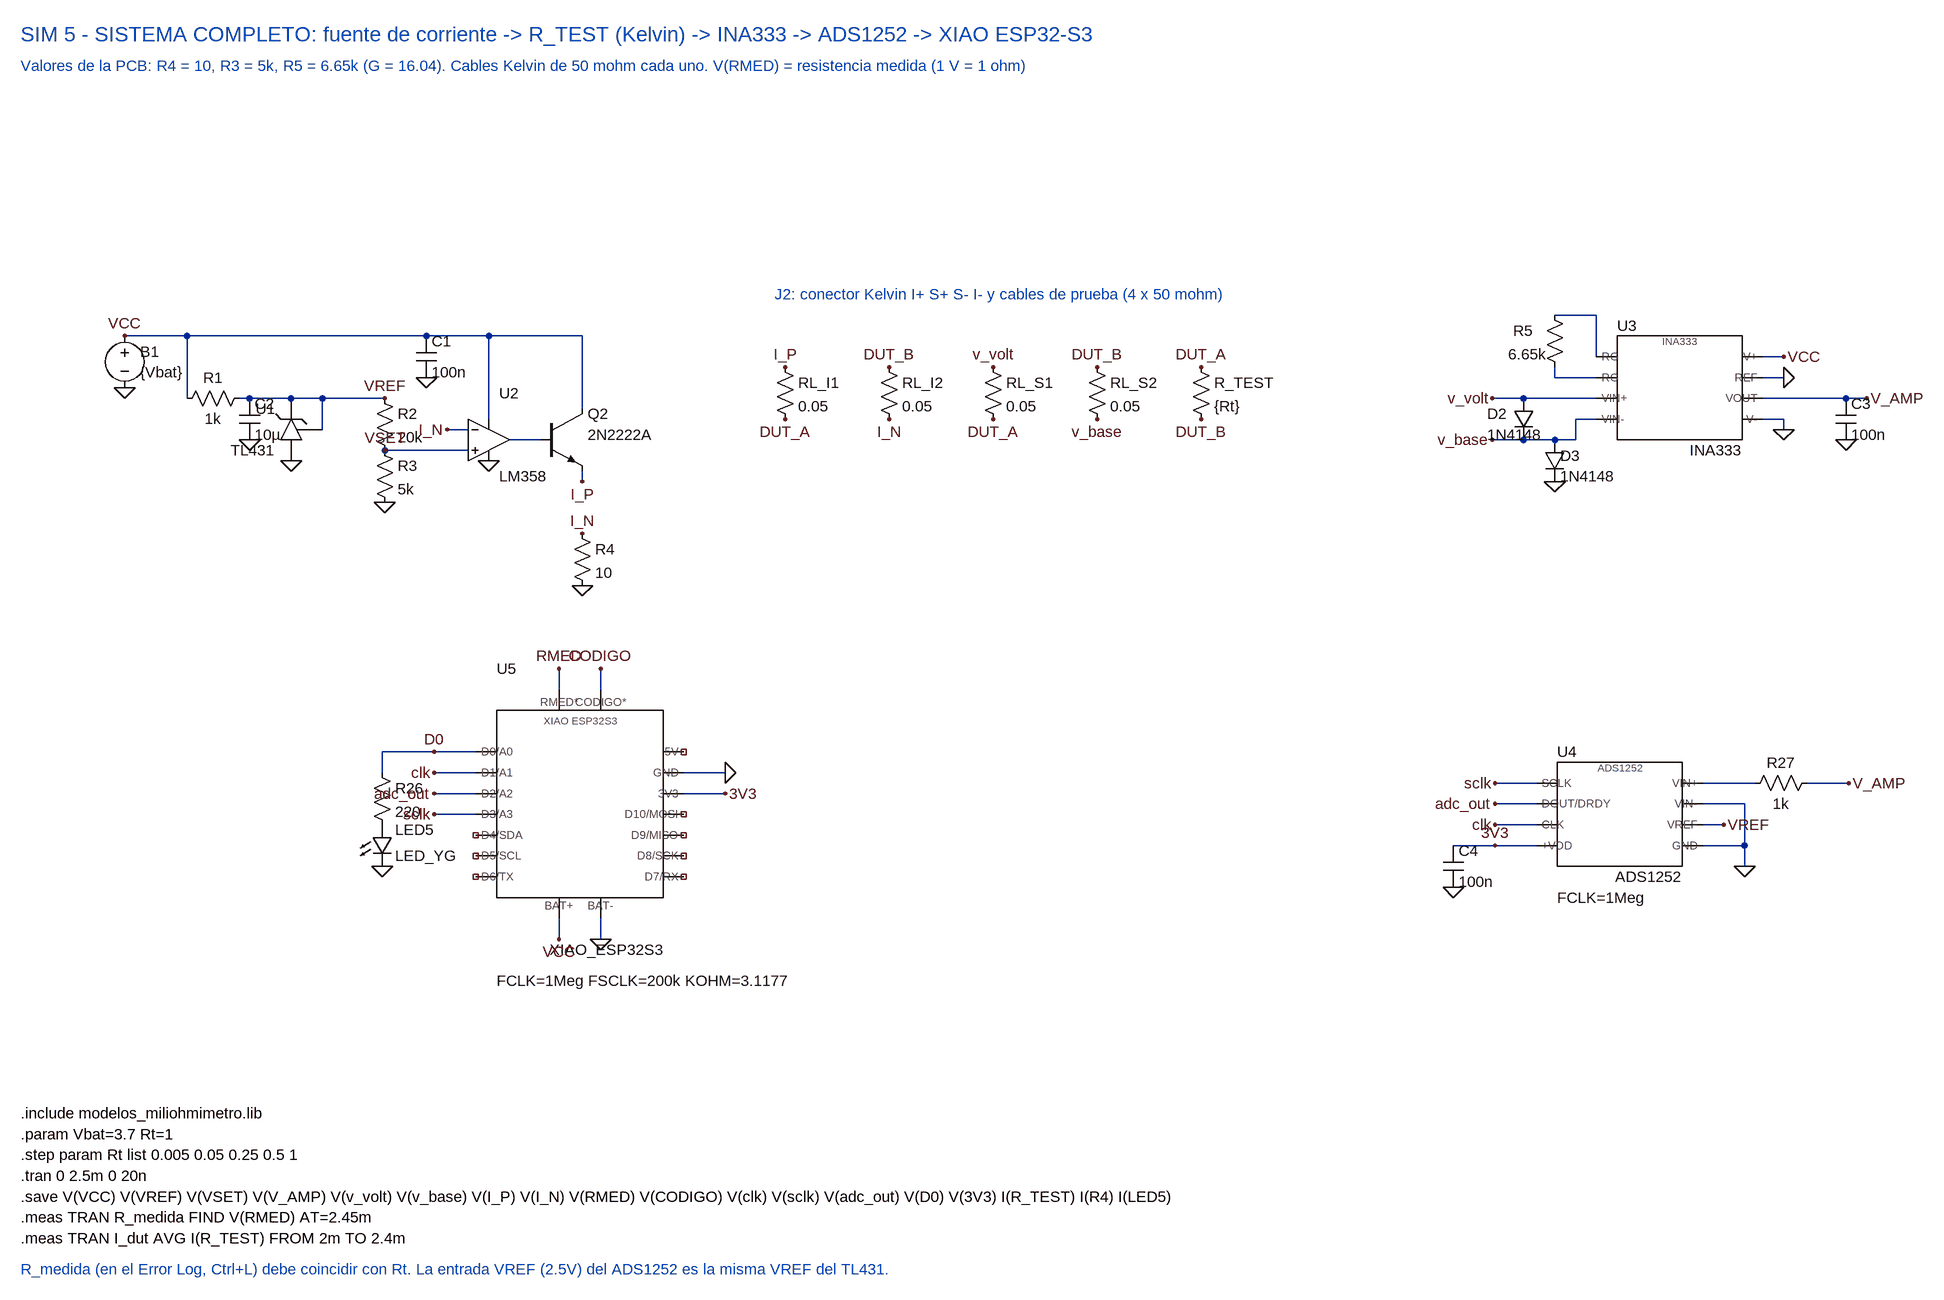
[diagram p0: schematic Sim5_Sistema_Completo.asc]
Sim5_Sistema_Completo.asc, the LTspice schematic file:
Version 4
SHEET 1 3600 2400
WIRE 0 -96 96 -96
WIRE 96 -96 560 -96
WIRE 560 -96 704 -96
WIRE 96 -96 96 0
WIRE 176 0 304 0
WIRE 304 0 400 0
WIRE 304 48 304 0
WIRE 400 80 528 80
WIRE 560 32 560 -96
WIRE 528 48 496 48
WIRE 592 64 640 64
WIRE 704 16 704 -96
WIRE 704 112 704 128
WIRE 2104 0 2264 0
WIRE 2104 64 2232 64
WIRE 2232 64 2232 32
WIRE 2232 32 2264 32
WIRE 2200 -128 2264 -128
WIRE 2264 -128 2264 -64
WIRE 2200 -48 2200 -32
WIRE 2200 -32 2264 -32
WIRE 2520 -64 2552 -64
WIRE 2520 -32 2552 -32
WIRE 2520 32 2552 32
WIRE 2552 32 2552 48
WIRE 2520 0 2680 0
WIRE 2428 592 2508 592
WIRE 2588 592 2652 592
WIRE 2428 624 2492 624
WIRE 2492 624 2492 688
WIRE 2428 688 2492 688
WIRE 2492 688 2492 720
WIRE 2428 656 2460 656
WIRE 2172 592 2108 592
WIRE 2172 624 2108 624
WIRE 2172 656 2108 656
WIRE 2172 688 2108 688
WIRE 2044 688 2108 688
WIRE 540 544 476 544
WIRE 540 576 476 576
WIRE 540 608 476 608
WIRE 540 640 476 640
WIRE 860 576 924 576
WIRE 860 608 924 608
WIRE 668 800 668 832
WIRE 732 800 732 832
WIRE 668 448 668 416
WIRE 732 448 732 416
WIRE 476 544 396 544
WIRE 396 544 396 576
FLAG 0 -16 0
FLAG 0 -96 VCC
FLAG 192 64 0
FLAG 256 96 0
FLAG 400 0 VREF
FLAG 400 160 0
FLAG 400 80 VSET
FLAG 464 -32 0
FLAG 560 96 0
FLAG 496 48 I_N
FLAG 704 128 I_P
FLAG 704 288 0
FLAG 704 208 I_N
FLAG 1016 -48 I_P
FLAG 1016 32 DUT_A
FLAG 1176 -48 DUT_B
FLAG 1176 32 I_N
FLAG 1336 -48 v_volt
FLAG 1336 32 DUT_A
FLAG 1496 -48 DUT_B
FLAG 1496 32 v_base
FLAG 1656 -48 DUT_A
FLAG 1656 32 DUT_B
FLAG 2104 0 v_volt
FLAG 2104 64 v_base
FLAG 2200 128 0
FLAG 2552 -64 VCC
FLAG 2552 -32 0
FLAG 2552 48 0
FLAG 2680 0 V_AMP
FLAG 2648 64 0
FLAG 2652 592 V_AMP
FLAG 2492 720 0
FLAG 2460 656 VREF
FLAG 2108 592 sclk
FLAG 2108 624 adc_out
FLAG 2108 656 clk
FLAG 2108 688 3V3
FLAG 2044 752 0
FLAG 476 544 D0
FLAG 476 576 clk
FLAG 476 608 adc_out
FLAG 476 640 sclk
FLAG 924 576 0
FLAG 924 608 3V3
FLAG 668 832 VCC
FLAG 732 832 0
FLAG 668 416 RMED
FLAG 732 416 CODIGO
FLAG 396 720 0
SYMBOL voltage 0 -112 R0
WINDOW 0 24 40 Left 2
WINDOW 3 24 72 Left 2
SYMATTR InstName B1
SYMATTR Value {Vbat}
SYMBOL res 192 -16 R90
WINDOW 0 0 56 VBottom 2
WINDOW 3 32 56 VTop 2
SYMATTR InstName R1
SYMATTR Value 1k
SYMBOL cap 176 0 R0
WINDOW 0 24 8 Left 2
WINDOW 3 24 56 Left 2
SYMATTR InstName C2
SYMATTR Value 10µ
SYMBOL TL431 256 0 R0
SYMATTR InstName U1
SYMATTR Value TL431
SYMBOL res 384 -16 R0
WINDOW 0 36 40 Left 2
WINDOW 3 36 76 Left 2
SYMATTR InstName R2
SYMATTR Value 20k
SYMBOL res 384 64 R0
WINDOW 0 36 40 Left 2
WINDOW 3 36 76 Left 2
SYMATTR InstName R3
SYMATTR Value 5k
SYMBOL cap 448 -96 R0
WINDOW 0 24 8 Left 2
WINDOW 3 24 56 Left 2
SYMATTR InstName C1
SYMATTR Value 100n
SYMBOL OpAmps\\opamp2 560 0 R0
WINDOW 0 16 -8 Left 2
WINDOW 3 16 120 Left 2
SYMATTR InstName U2
SYMATTR Value LM358
SYMBOL npn 640 16 R0
WINDOW 0 72 8 Left 2
WINDOW 3 72 40 Left 2
SYMATTR InstName Q2
SYMATTR Value 2N2222A
SYMBOL res 688 192 R0
WINDOW 0 36 40 Left 2
WINDOW 3 36 76 Left 2
SYMATTR InstName R4
SYMATTR Value 10
SYMBOL res 1000 -64 R0
WINDOW 0 36 40 Left 2
WINDOW 3 36 76 Left 2
SYMATTR InstName RL_I1
SYMATTR Value 0.05
SYMBOL res 1160 -64 R0
WINDOW 0 36 40 Left 2
WINDOW 3 36 76 Left 2
SYMATTR InstName RL_I2
SYMATTR Value 0.05
SYMBOL res 1320 -64 R0
WINDOW 0 36 40 Left 2
WINDOW 3 36 76 Left 2
SYMATTR InstName RL_S1
SYMATTR Value 0.05
SYMBOL res 1480 -64 R0
WINDOW 0 36 40 Left 2
WINDOW 3 36 76 Left 2
SYMATTR InstName RL_S2
SYMATTR Value 0.05
SYMBOL res 1640 -64 R0
WINDOW 0 36 40 Left 2
WINDOW 3 36 76 Left 2
SYMATTR InstName R_TEST
SYMATTR Value {Rt}
SYMBOL INA333 2392 0 R0
WINDOW 0 -96 -112 Left 2
WINDOW 3 96 80 Right 2
SYMATTR InstName U3
SYMATTR Value INA333
SYMBOL diode 2136 0 R0
WINDOW 0 -40 24 Left 2
WINDOW 3 -40 56 Left 2
SYMATTR InstName D2
SYMATTR Value 1N4148
SYMBOL diode 2184 64 R0
WINDOW 0 24 24 Left 2
WINDOW 3 24 56 Left 2
SYMATTR InstName D3
SYMATTR Value 1N4148
SYMBOL res 2184 -144 R0
WINDOW 0 -48 40 Left 2
WINDOW 3 -56 76 Left 2
SYMATTR InstName R5
SYMATTR Value 6.65k
SYMBOL cap 2632 0 R0
WINDOW 0 24 8 Left 2
WINDOW 3 24 56 Left 2
SYMATTR InstName C3
SYMATTR Value 100n
SYMBOL ADS1252 2300 640 R0
WINDOW 0 -96 -96 Left 2
WINDOW 3 96 96 Right 2
WINDOW 39 -96 128 Left 2
SYMATTR InstName U4
SYMATTR Value ADS1252
SYMATTR SpiceLine FCLK=1Meg
SYMBOL res 2604 576 R90
WINDOW 0 0 56 VBottom 2
WINDOW 3 32 56 VTop 2
SYMATTR InstName R27
SYMATTR Value 1k
SYMBOL cap 2028 688 R0
WINDOW 0 24 8 Left 2
WINDOW 3 24 56 Left 2
SYMATTR InstName C4
SYMATTR Value 100n
SYMBOL XIAO_ESP32S3 700 640 R0
WINDOW 0 -128 -224 Left 2
WINDOW 3 128 208 Right 2
WINDOW 39 -128 256 Left 2
SYMATTR InstName U5
SYMATTR Value XIAO_ESP32S3
SYMATTR SpiceLine FCLK=1Meg FSCLK=200k KOHM=3.1177
SYMBOL res 380 560 R0
WINDOW 0 36 40 Left 2
WINDOW 3 36 76 Left 2
SYMATTR InstName R26
SYMATTR Value 220
SYMBOL LED 380 656 R0
WINDOW 0 36 8 Left 2
WINDOW 3 36 48 Left 2
SYMATTR InstName LED5
SYMATTR Value LED_YG
TEXT -160 -560 Left 3 ;SIM 5 - SISTEMA COMPLETO: fuente de corriente -> R_TEST (Kelvin) -> INA333 -> ADS1252 -> XIAO ESP32-S3
TEXT -160 -512 Left 2 ;Valores de la PCB: R4 = 10, R3 = 5k, R5 = 6.65k (G = 16.04). Cables Kelvin de 50 mohm cada uno. V(RMED) = resistencia medida (1 V = 1 ohm)
TEXT 1000 -160 Left 2 ;J2: conector Kelvin I+ S+ S- I- y cables de prueba (4 x 50 mohm)
TEXT -160 1100 Left 2 !.include modelos_miliohmimetro.lib
TEXT -160 1132 Left 2 !.param Vbat=3.7 Rt=1
TEXT -160 1164 Left 2 !.step param Rt list 0.005 0.05 0.25 0.5 1
TEXT -160 1196 Left 2 !.tran 0 2.5m 0 20n
TEXT -160 1228 Left 2 !.save V(VCC) V(VREF) V(VSET) V(V_AMP) V(v_volt) V(v_base) V(I_P) V(I_N) V(RMED) V(CODIGO) V(clk) V(sclk) V(adc_out) V(D0) V(3V3) I(R_TEST) I(R4) I(LED5)
TEXT -160 1260 Left 2 !.meas TRAN R_medida FIND V(RMED) AT=2.45m
TEXT -160 1292 Left 2 !.meas TRAN I_dut AVG I(R_TEST) FROM 2m TO 2.4m
TEXT -160 1340 Left 2 ;R_medida (en el Error Log, Ctrl+L) debe coincidir con Rt. La entrada VREF (2.5V) del ADS1252 es la misma VREF del TL431.

The netlist it stands for:
* Sim5_Sistema_Completo.asc
V§B1 VCC 0 {Vbat}
R1 VREF VCC 1k
C2 VREF 0 10µ
XU1 VREF 0 VREF TL431  ; pins K A REF
R2 VREF VSET 20k
R3 VSET 0 5k
C1 VCC 0 100n
XU2 VSET I_N VCC 0 N001 LM358  ; pins In+ In- V+ V- OUT
Q2 VCC N001 I_P 0 2N2222A
R4 I_N 0 10
RL_I1 I_P DUT_A 0.05
RL_I2 DUT_B I_N 0.05
RL_S1 v_volt DUT_A 0.05
RL_S2 DUT_B v_base 0.05
R_TEST DUT_A DUT_B {Rt}
XU3 N003 v_base v_volt 0 0 V_AMP VCC N002 INA333  ; pins RG VIN- VIN+ V- REF VOUT V+ RG
D2 v_volt v_base 1N4148
D3 v_base 0 1N4148
R5 N002 N003 6.65k
C3 V_AMP 0 100n
XU4 N004 0 3V3 clk adc_out sclk 0 VREF ADS1252 FCLK=1Meg  ; pins VIN+ VIN- +VDD CLK DOUT/DRDY SCLK GND VREF
R27 V_AMP N004 1k
C4 3V3 0 100n
XU5 D0 clk adc_out sclk NC_01 NC_02 NC_03 NC_04 NC_05 NC_06 NC_07 3V3 0 NC_08 VCC 0 RMED CODIGO XIAO_ESP32S3 FCLK=1Meg FSCLK=200k KOHM=3.1177  ; pins D0/A0 D1/A1 D2/A2 D3/A3 D4/SDA D5/SCL D6/TX D7/RX D8/SCK D9/MISO D10/MOSI 3V3 GND 5V BAT+ BAT- RMED* CODIGO*
R26 D0 P001 220
D§LED5 P001 0 LED_YG
.model D D
.lib standard.dio
.model NPN NPN
.model PNP PNP
.lib standard.bjt
* SIM 5 - SISTEMA COMPLETO: fuente de corriente -> R_TEST (Kelvin) -> INA333 -> ADS1252 -> XIAO ESP32-S3
* Valores de la PCB: R4 = 10, R3 = 5k, R5 = 6.65k (G = 16.04). Cables Kelvin de 50 mohm cada uno. V(RMED) = resistencia medida (1 V = 1 ohm)
* J2: conector Kelvin I+ S+ S- I- y cables de prueba (4 x 50 mohm)
.include modelos_miliohmimetro.lib
.param Vbat=3.7 Rt=1
.step param Rt list 0.005 0.05 0.25 0.5 1
.tran 0 2.5m 0 20n
.save V(VCC) V(VREF) V(VSET) V(V_AMP) V(v_volt) V(v_base) V(I_P) V(I_N) V(RMED) V(CODIGO) V(clk) V(sclk) V(adc_out) V(D0) V(3V3) I(R_TEST) I(R4) I(LED5)
.meas TRAN R_medida FIND V(RMED) AT=2.45m
.meas TRAN I_dut AVG I(R_TEST) FROM 2m TO 2.4m
* R_medida (en el Error Log, Ctrl+L) debe coincidir con Rt. La entrada VREF (2.5V) del ADS1252 es la misma VREF del TL431.
.backanno
.end